# Altium schematic sheet Schematic.SchDoc
size A; SheetNumber: 1; SheetTotal: 1
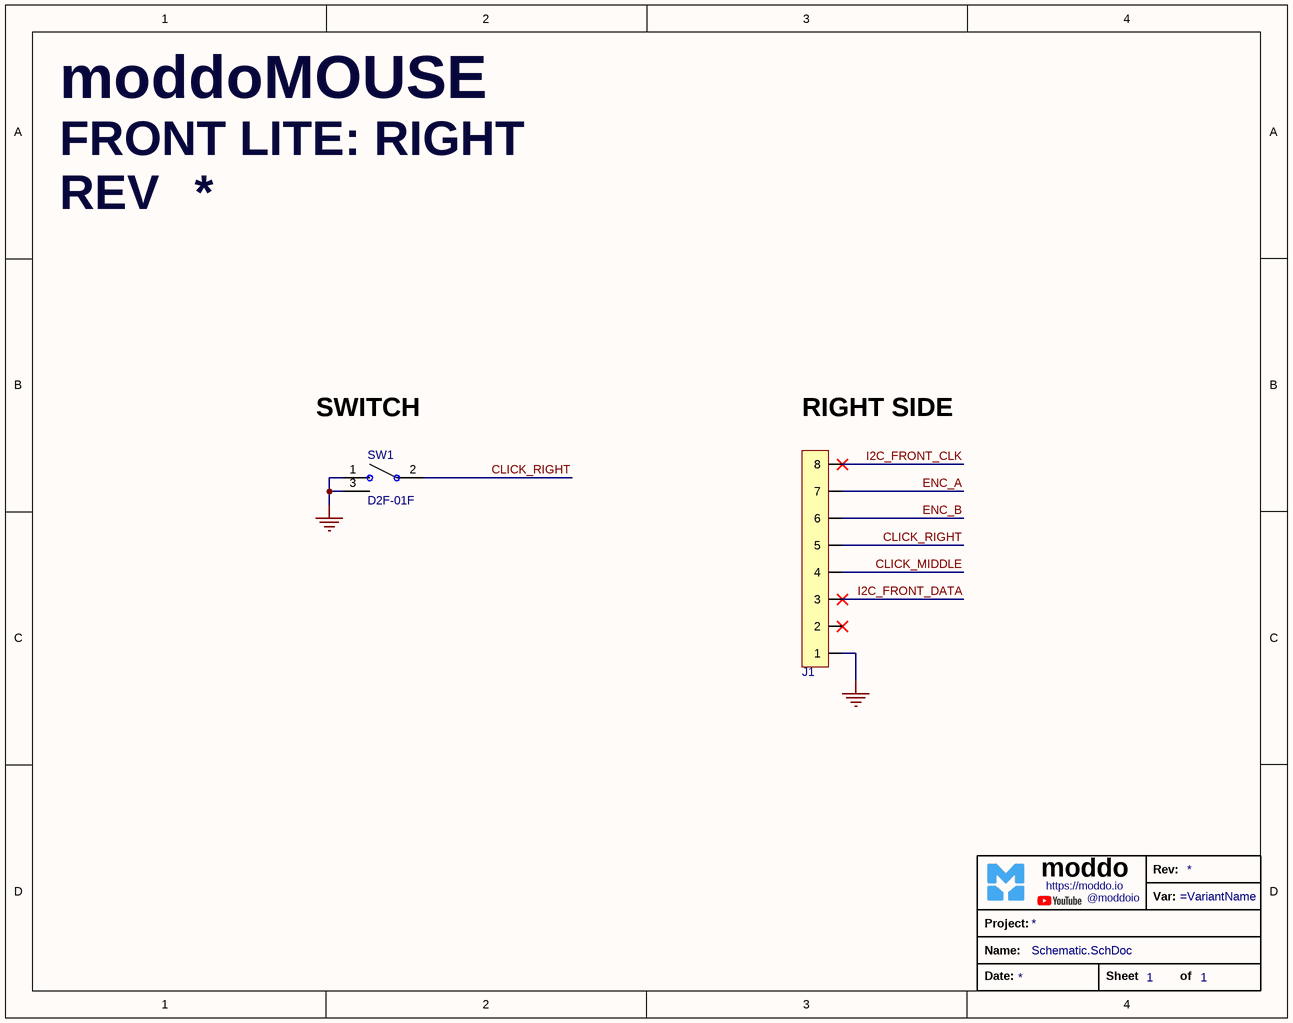
[diagram p0: Schematic.SchDoc]

## Parts
?  TitleBlock_moddo  (value not drawn)  (graphical)
J1  1.27mm_8pins  [HEADER_MALE_1_27mm_8p_HEIGHT_1mm]  (value not drawn)
SW1  D2F-01F  [Microswitch]

## Nets
GND: J1.1 SW1.1 SW1.3
CLICK_MIDDLE: J1.4
CLICK_RIGHT: J1.5 SW1.2
ENC_A: J1.7
ENC_B: J1.6
I2C_FRONT_CLK: J1.8
I2C_FRONT_DATA: J1.3

Not connected (* = marked no-connect by the designer): J1 2*

## Notes on the sheet
- moddoMOUSE <https://protorig.io/>
- FRONT LITE: RIGHT <https://protorig.io/>
- REV
- SWITCH
- (near J1) RIGHT SIDE
- (in symbol TitleBlock_moddo) Rev:; moddo; https://moddo.io; Var:; @moddoio; Project:; Name:; Date:; Sheet; of

## Library data of the parts
J1 = 1.27mm_8pins: 1.27mm 1.27mm 1A 1 Gold -40℃~+105℃ 8P Phosphor Bronze Through Hole 1x8P Top 4.3mm Square Hole Through Hole,P=1.27mm Female Headers ROHS
SW1 = Microswitch: SWITCH SNAP ACTION SPDT 0.1A 30V; Manufacturer: Omron Electronics Inc-EMC Div; Manufacturer Part Number: D2F-01F